# EAGLE design Spectacle_Audio_Output_Board (EAGLE 7.6.0)

## Sheet 1 of 2
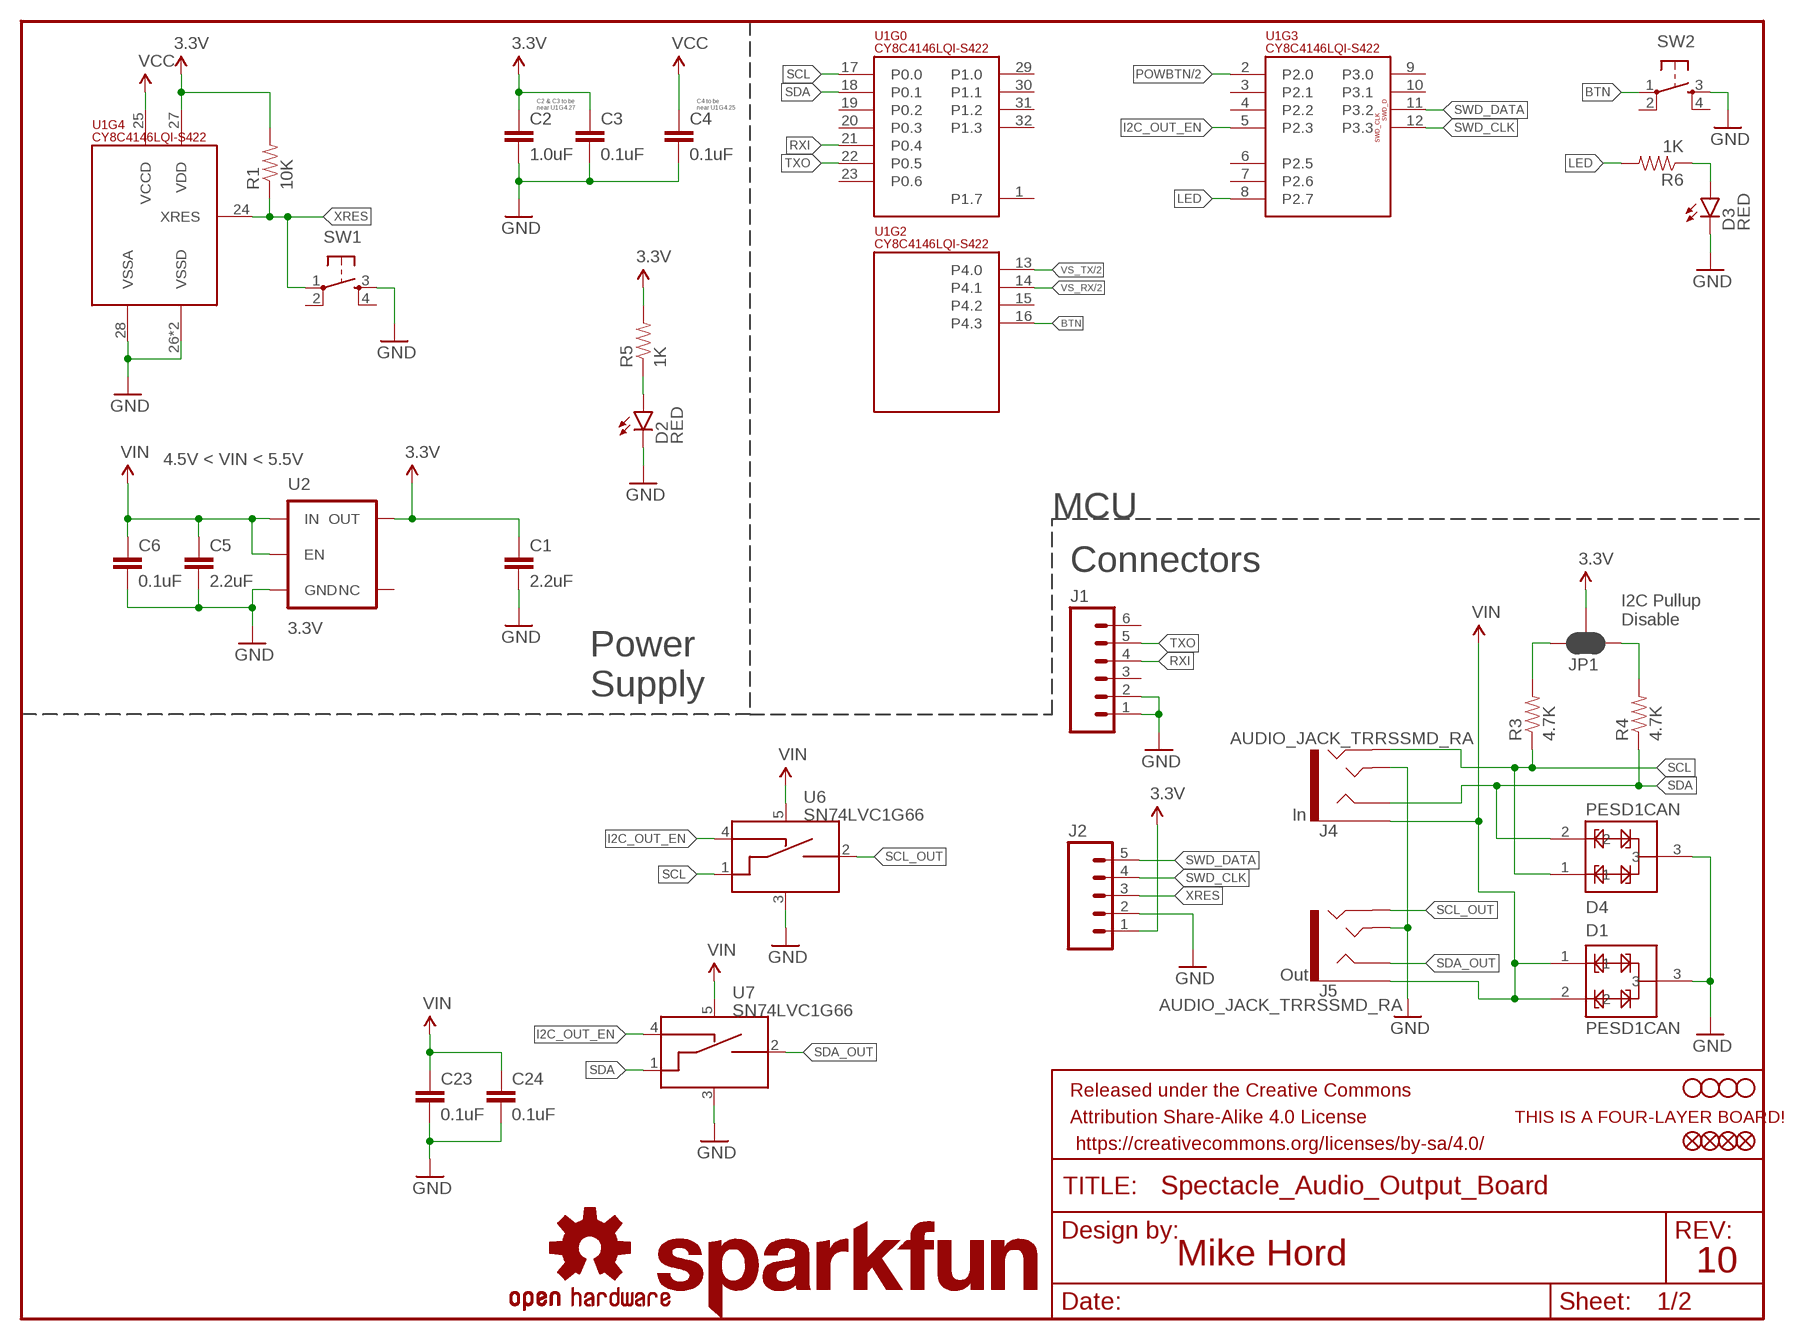
[diagram p0: schematic, sheet 1]

### Parts
C1  2.2uF  2.2UF-10V-20%(0603)  [0603-CAP]
C2  1.0uF  1.0UF-16V-10%(0402)  [0402-CAP]
C3  0.1uF  0.1UF-16V(+-10%)(0402)  [0402-CAP]
C4  0.1uF  0.1UF-16V(+-10%)(0402)  [0402-CAP]
C5  2.2uF  2.2UF-10V-20%(0603)  [0603-CAP]
C6  0.1uF  0.1UF-16V(+-10%)(0402)  [0402-CAP]
C23  0.1uF  0.1UF-16V(+-10%)(0402)  [0402-CAP]
C24  0.1uF  0.1UF-16V(+-10%)(0402)  [0402-CAP]
D1  PESD1CAN  [SOT23-3]
D2  RED  LED-RED0603  [LED-0603]
D3  RED  LED-RED0603  [LED-0603]
D4  PESD1CAN  [SOT23-3]
FD5  FIDUCIALUFIDUCIAL  [MICRO-FIDUCIAL]
FD6  FIDUCIALUFIDUCIAL  [MICRO-FIDUCIAL]
FD7  FIDUCIALUFIDUCIAL  [MICRO-FIDUCIAL]
FD8  FIDUCIALUFIDUCIAL  [MICRO-FIDUCIAL]
FRAME1  FRAME-LETTER  [CREATIVE_COMMONS]
H1  STAND-OFF  [STAND-OFF]
H2  STAND-OFF  [STAND-OFF]
H3  STAND-OFF  [STAND-OFF]
H4  STAND-OFF  [STAND-OFF]
J1  M06NO_SILK_NO_POP  [1X06_NO_SILK]
J2  M05NO_SILK  [1X05_NO_SILK]
J4  AUDIO_JACK_TRRSSMD_RA  [AUDIO_JACK_3.5MM_TRRS_SMD_RA]
J5  AUDIO_JACK_TRRSSMD_RA  [AUDIO_JACK_3.5MM_TRRS_SMD_RA]
JP1  JUMPER-PAD-3-NC_BY_PASTE  [PAD-JUMPER-3-NC_BY_PASTE_YES_SILK_FULL_BOX]
LOGO1  OSHW-LOGOS  [OSHW-LOGO-S]
LOGO2  SFE_LOGO_NAME.1_INCH  [SFE_LOGO_NAME_.1]
R1  10K  10KOHM-1/10W-1%(0603)0603  [0603-RES]
R3  4.7K  4.7KOHM-1/10W-1%(0603)  [0603-RES]
R4  4.7K  4.7KOHM-1/10W-1%(0603)  [0603-RES]
R5  1K  1KOHM-1/10W-1%(0603)  [0603-RES]
R6  1K  1KOHM-1/10W-1%(0603)  [0603-RES]
SW1  SWITCH_SPST_4_PINRECT  [TACTILE_SWITCH_SMD_4.6X2.8MM]
SW2  SWITCH_SPST_4_PINRECT  [TACTILE_SWITCH_SMD_4.6X2.8MM]
U1  CY8C4146LQI-S422  PSOC4_4100S_32QFN  [QFN-32]
U2  3.3V  V_REG_AP2112K-3.3V  [SOT23-5]
U6  SN74LVC1G66  SN74LVC1G66_SPST_AMUX  [SOT23-5]
U7  SN74LVC1G66  SN74LVC1G66_SPST_AMUX  [SOT23-5]
U$1  FOUR_LAYER_WARNING  [FOUR_LAYER_WARNING]

### Nets
3.3V: C1.1 C2.1 C3.1 J2.1 JP1.2 R1.2 R5.2 U1.27(VDD) U2.5(OUT) ; also sheet 2
BTN: SW2.1 U1.16(P4.3)
GND: C1.2 C2.2 C3.2 C4.2 C5.2 C6.2 C23.2 C24.2 D1.3 D2.C D3.C D4.3 J1.1 J1.2 J2.2 J4.TIP J5.TIP SW1.3 SW2.3 U1.26(VSSD) U1.28(VSSA) U1.EP(VSSD) U2.2(GND) U6.3(VSS) U7.3(VSS) ; also sheet 2
I2C_OUT_EN: U1.5(P2.3) U6.4(CTRL_IN) U7.4(CTRL_IN)
LED: R6.2 U1.8(P2.7)
N$2: JP1.3 R3.2
N$4: D2.A R5.1
N$5: D3.A R6.1
N$6: JP1.1 R4.2
POWBTN: U1.2(P2.0) ; also sheet 2
RXI: J1.4 U1.21(P0.4)
SCL: D4.1 J4.RING2 R3.1 U1.17(P0.0) U6.1(A_IN)
SCL_OUT: J5.RING2 U6.2(A_OUT)
SDA: D4.2 J4.RING1 R4.1 U1.18(P0.1) U7.1(A_IN)
SDA_OUT: J5.RING1 U7.2(A_OUT)
SWD_CLK: J2.4 U1.12(P3.3)
SWD_DATA: J2.5 U1.11(P3.2)
TXO: J1.5 U1.22(P0.5)
VCC: C4.1 U1.25(VCCD)
VIN: C5.1 C6.1 C23.1 C24.1 D1.1 D1.2 J4.EARTH J5.EARTH U2.1(IN) U2.3(EN) U6.5(VCC) U7.5(VCC) ; also sheet 2
VS_RX: U1.14(P4.1) ; also sheet 2
VS_TX: U1.13(P4.0) ; also sheet 2
XRES: J2.3 R1.1 SW1.1 U1.24(XRES)
Unconnected: J1.3 J1.6 SW1.2 SW1.4 SW2.2 SW2.4 U1.1(P1.7) U1.3(P2.1) U1.4(P2.2) U1.6(P2.5) U1.7(P2.6) U1.9(P3.0) U1.10(P3.1) U1.15(P4.2) U1.19(P0.2) U1.20(P0.3) U1.23(P0.6) U1.29(P1.0) U1.30(P1.1) U1.31(P1.2) U1.32(P1.3) U2.4(NC)

### Notes on the sheet
- C2 & C3 to be
  near U1G4.27
- C4 to be
  near U1G4.25
- 4.5V < VIN < 5.5V
- MCU
- Connectors
- I2C Pullup
  Disable
- Power
  Supply
- In
- Out
- Mike Hord | 10

## Sheet 2 of 2
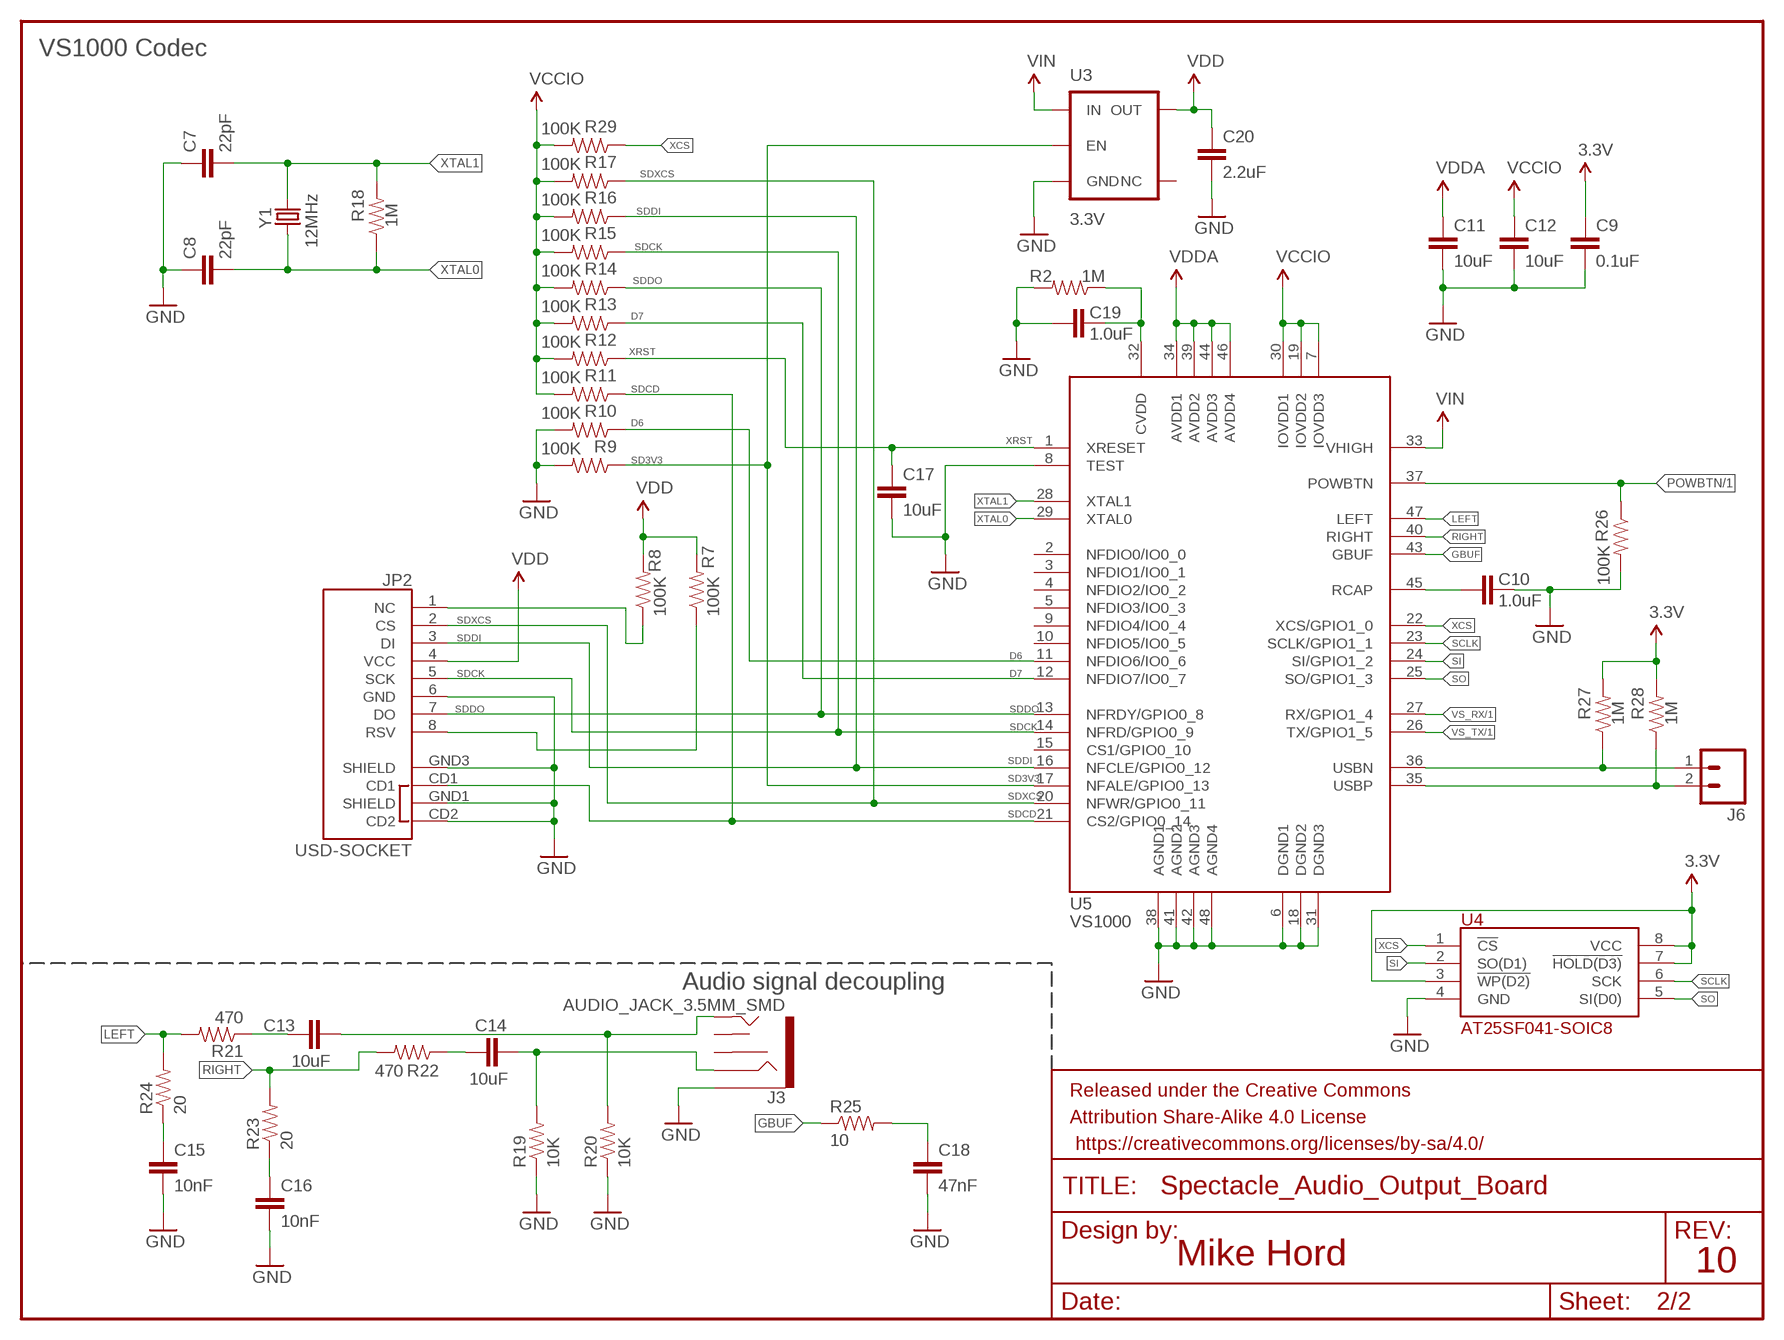
[diagram p1: schematic, sheet 2]

### Parts
C7  22pF  22PF-50V-5%(0603)  [0603-CAP]
C8  22pF  22PF-50V-5%(0603)  [0603-CAP]
C9  0.1uF  0.1UF-16V(+-10%)(0402)  [0402-CAP]
C10  1.0uF  1.0UF-16V-10%(0402)  [0402-CAP]
C11  10uF  10UF-6.3V-20%(0603)  [0603-CAP]
C12  10uF  10UF-6.3V-20%(0603)  [0603-CAP]
C13  10uF  10UF-6.3V-20%(0603)  [0603-CAP]
C14  10uF  10UF-6.3V-20%(0603)  [0603-CAP]
C15  10nF  10NF/10000PF-50V-10%(0603)  [0603-CAP]
C16  10nF  10NF/10000PF-50V-10%(0603)  [0603-CAP]
C17  10uF  10UF-6.3V-20%(0603)  [0603-CAP]
C18  47nF  47NF(0.047UF/47000PF)-25V-5%(0603)SMD  [0603-CAP]
C19  1.0uF  1.0UF-16V-10%(0402)  [0402-CAP]
C20  2.2uF  2.2UF-10V-20%(0603)  [0603-CAP]
FRAME2  FRAME-LETTER  [CREATIVE_COMMONS]
J3  AUDIO_JACK_3.5MM_SMD  [AUDIO-JACK-3.5MM-SMD]
J6  M021X02_NO_SILK  [1X02_NO_SILK]
JP2  USD-SOCKET  [MICROSD_1:1]
R2  1M  1MOHM-1/10W-1%(0603)  [0603-RES]
R7  100K  100KOHM-1/16W-1%(0402)  [0402-RES]
R8  100K  100KOHM-1/16W-1%(0402)  [0402-RES]
R9  100K  100KOHM-1/16W-1%(0402)  [0402-RES]
R10  100K  100KOHM-1/16W-1%(0402)  [0402-RES]
R11  100K  100KOHM-1/16W-1%(0402)  [0402-RES]
R12  100K  100KOHM-1/16W-1%(0402)  [0402-RES]
R13  100K  100KOHM-1/16W-1%(0402)  [0402-RES]
R14  100K  100KOHM-1/16W-1%(0402)  [0402-RES]
R15  100K  100KOHM-1/16W-1%(0402)  [0402-RES]
R16  100K  100KOHM-1/16W-1%(0402)  [0402-RES]
R17  100K  100KOHM-1/16W-1%(0402)  [0402-RES]
R18  1M  1MOHM-1/10W-1%(0603)  [0603-RES]
R19  10K  10KOHM-1/10W-1%(0603)0603  [0603-RES]
R20  10K  10KOHM-1/10W-1%(0603)0603  [0603-RES]
R21  470  470OHM1/10W1%(0603)  [0603-RES]
R22  470  470OHM1/10W1%(0603)  [0603-RES]
R23  20  20OHM1/10W1%(0603)SMD  [0603-RES]
R24  20  20OHM1/10W1%(0603)SMD  [0603-RES]
R25  10  10OHM-1/10W-5%0603SMD  [0603-RES]
R26  100K  100KOHM-1/16W-1%(0402)  [0402-RES]
R27  1M  1MOHM-1/10W-1%(0603)  [0603-RES]
R28  1M  1MOHM-1/10W-1%(0603)  [0603-RES]
R29  100K  100KOHM-1/16W-1%(0402)  [0402-RES]
U3  3.3V  V_REG_AP2112K-3.3V  [SOT23-5]
U4  AT25SF041-SOIC8  AT25SF041  [SO08]
U5  VS1000  [LQFP-48]
Y1  12MHz  CRYSTALCRYSTAL-SMD-5X3-12MHZ  [CRYSTAL-SMD-5X3]

### Nets
3.3V: C9.1 R27.2 R28.2 U4.3(!WP(D2)) U4.7(!HOLD(D3)) U4.8(VCC) ; also sheet 1
D6: R10.1 U5.11(NFDIO6/IO0_6)
D7: R13.1 U5.12(NFDIO7/IO0_7)
GBUF: R25.1 U5.43(GBUF)
GND: C7.1 C8.1 C9.2 C10.2 C11.2 C12.2 C15.2 C16.2 C17.2 C18.2 C19.1 C20.2 J3.SLEEVE JP2.6(GND) JP2.CD2 JP2.GND1(SHIELD) JP2.GND3(SHIELD) R2.2 R9.2 R10.2 R19.1 R20.1 R26.2 U3.2(GND) U4.4(GND) U5.6(DGND1) U5.8(TEST) U5.18(DGND2) U5.31(DGND3) U5.38(AGND1) U5.41(AGND2) U5.42(AGND3) U5.48(AGND4) ; also sheet 1
L_AC: C13.2 J3.TIP R20.2
LEFT: R21.2 R24.2 U5.47(LEFT)
N$1: JP2.1(NC) R8.1
N$7: JP2.8(RSV) R7.1
N$8: C13.1 R21.1
N$9: C15.1 R24.1
N$10: C18.1 R25.2
N$11: C10.1 U5.45(RCAP)
N$12: C19.2 R2.1 U5.32(CVDD)
N$17: C14.1 R22.1
N$20: C16.1 R23.1
POWBTN: R26.1 U5.37(POWBTN) ; also sheet 1
R_AC: C14.2 J3.RING R19.2
RIGHT: R22.2 R23.2 U5.40(RIGHT)
SCLK: U4.6(SCK) U5.23(SCLK/GPIO1_1)
SD3V3: R9.1 U3.3(EN) U5.17(NFALE/GPIO0_13)
SDCD: JP2.CD1 R11.1 U5.21(CS2/GPIO0_14)
SDCK: JP2.5(SCK) R15.1 U5.14(NFRD/GPIO0_9)
SDDI: JP2.3(DI) R16.1 U5.16(NFCLE/GPIO0_12)
SDDO: JP2.7(DO) R14.1 U5.13(NFRDY/GPIO0_8)
SDXCS: JP2.2(CS) R17.1 U5.20(NFWR/GPIO0_11)
SI: U4.2(SO(D1)) U5.24(SI/GPIO1_2)
SO: U4.5(SI(D0)) U5.25(SO/GPIO1_3)
USBN: J6.1 R27.1 U5.36(USBN)
USBP: J6.2 R28.1 U5.35(USBP)
VCCIO: C12.1 R11.2 R12.2 R13.2 R14.2 R15.2 R16.2 R17.2 R29.2 U5.7(IOVDD3) U5.19(IOVDD2) U5.30(IOVDD1)
VDD: C20.1 JP2.4(VCC) R7.2 R8.2 U3.5(OUT)
VDDA: C11.1 U5.34(AVDD1) U5.39(AVDD2) U5.44(AVDD3) U5.46(AVDD4)
VIN: U3.1(IN) U5.33(VHIGH) ; also sheet 1
VS_RX: U5.27(RX/GPIO1_4) ; also sheet 1
VS_TX: U5.26(TX/GPIO1_5) ; also sheet 1
XCS: R29.1 U4.1(!CS) U5.22(XCS/GPIO1_0)
XRST: C17.1 R12.1 U5.1(XRESET)
XTAL0: C8.2 R18.1 U5.29(XTAL0) Y1.1
XTAL1: C7.2 R18.2 U5.28(XTAL1) Y1.3
Unconnected: J3.RSH J3.TSH U3.4(NC) U5.2(NFDIO0/IO0_0) U5.3(NFDIO1/IO0_1) U5.4(NFDIO2/IO0_2) U5.5(NFDIO3/IO0_3) U5.9(NFDIO4/IO0_4) U5.10(NFDIO5/IO0_5) U5.15(CS1/GPIO0_10)

### Notes on the sheet
- VS1000 Codec
- Audio signal decoupling
- Mike Hord | 10

## Library data of the parts
C1 C5 C20 = SparkFun-Capacitors:2.2UF-10V-20%(0603): CAP-07888; PROD_ID: CAP-07888
C2 C10 C19 = SparkFun-Capacitors:1.0UF-16V-10%(0402); PROD_ID: CAP-12417
C3 C4 C6 C9 C23 C24 = SparkFun-Capacitors:0.1UF-16V(+-10%)(0402); PROD_ID: CAP-12416
C7 C8 = SparkFun-Capacitors:22PF-50V-5%(0603): CAP-07876; PROD_ID: CAP-07876
C11-C14 C17 = SparkFun-Capacitors:10UF-6.3V-20%(0603): CAP-11015; PROD_ID: CAP-11015
C15 C16 = SparkFun-Capacitors:10NF/10000PF-50V-10%(0603): CAP-00867; PROD_ID: CAP-00867
C18 = SparkFun-Capacitors:47NF(0.047UF/47000PF)-25V-5%(0603): CAP-08605; PROD_ID: CAP-08605
D1 D4 = SparkFun-DiscreteSemi:PESD1CAN: PESD1CAN is used to protect two automotive CAN bus lines from ESD.; PROD_ID: DIO-12501
D2 D3 = SparkFun-LED:LED-RED: Assorted Red LEDs LilyPad 1206- DIO-09912 1206- DIO-00809 0603- DIO-00819 "SMART" means more efficient and expensive; PROD_ID: DIO-00819
FD5-FD8 = SparkFun-Aesthetics:FIDUCIAL: Fiducial Alignment Points Various fiducial points for machine vision alignment.
FRAME1 FRAME2 = SparkFun-Aesthetics:FRAME-LETTER: Schematic Frame Standard 8.5x11 US Letter frame
H1-H4 = SparkFun-Electromechanical:STAND-OFF: #4 Stand Off This is the mechanical footprint for a #4 phillips button head screw. Use the keepout ring to avoid running the screw head into surrounding components. SKU : PRT-00447
J1 = SparkFun-Connectors:M06: Header 6 Standard 6-pin 0.1" header. Use with straight break away headers (SKU : PRT-00116), right angle break away headers (PRT-00553), swiss pins (PRT-00743), machine pins (PRT-00117), and female headers (PRT-00115). Molex polarized connector foot print use with SKU : PRT-08094 with associated crimp pins and housings. NOTES ON THE VARIANTS LOCK and LOCK_LONGPADS... This footprint was designed to help hold the alignment of a through-hole component (i.e. 6-pin header) while soldering it into place. You may notice that each hole has been shifted either up or down by 0.005 of an inch from it's more standard position (which is a perfectly straight line). This slight alteration caused the pins (the squares in the middle) to touch the edges of the holes. Because they are alternating, it causes a "brace" to hold the component in place. 0.005 has proven to be the perfect amount of "off-center" position when using our standard breakaway headers. Although looks a little odd when you look at the bare footprint, once you have a header in there, the alteration is very hard to notice. Also,if you push a header all the way into place, it is covered up entirely on the bottom side. This idea of altering the position of holes to aid alignment will be further integrated into the Sparkfun Library for other footprints. It can help hold any component with 3 or more connection pins.
J2 = SparkFun-Connectors:M05: Header 5 Standard 5-pin 0.1" header. Use with straight break away headers (SKU : PRT-00116), right angle break away headers (PRT-00553), swiss pins (PRT-00743), machine pins (PRT-00117), and female headers (PRT-00115). Molex polarized connector foot print use with SKU : PRT-08230 with associated crimp pins and housings.
J3 = SparkFun-Connectors:AUDIO_JACK_3.5MM: Audio Jack 3.5mm variants of PTH and SMT stereo audio jack with bypass switches. SparkFun Products: SparkFun SparkPunk Sound Kit <[https://www.sparkfun.com/products/11177]> - PTH MP3 Trigger <https://www.sparkfun.com/products/13720> -3.5mm SMD SparkFun PicoBoard <https://www.sparkfun.com/products/11888>- 2.5mm SMD; PROD_ID: CONN-10353
J4 J5 = SparkFun-Connectors:AUDIO_JACK_TRRS: Audio Jack - 3.5mm TRRS (SMD) This is a 3.5mm TRRS SMD audio jack. TRRS connectors are the audio-style connectors that you see on some phones, MP3 players and development boards. TRRS stands for “tip, ring, ring, sleeve,” which reflects that this has three conductors and a ground. SparkFun Products: Audio Jack <https://www.sparkfun.com/products/12639> mbed Starter Kit <https://www.sparkfun.com/products/12968> SparkFun TRRS 3.5mm Jack Breakout <https://www.sparkfun.com/products/11570>; PROD_ID: CONN-10676; SF_ID: PRT-12639
J6 = SparkFun-Connectors:M02: Standard 2-pin 0.1" header. Use with - straight break away headers ( PRT-00116) - right angle break away headers (PRT-00553) - swiss pins (PRT-00743) - machine pins (PRT-00117) - female headers (PRT-00115) Molex polarized connector foot print use with: PRT-08233 with associated crimp pins and housings. 2.54_SCREWTERM for use with PRT-10571. 3.5mm Screw Terminal footprints for PRT-08084 5mm Screw Terminal footprints for use with PRT-08432
JP1 = SparkFun-Passives:JUMPER-PAD-3-NC_BY_PASTE
JP2 = SparkFun-Connectors:USD-SOCKET: microSD Socket Push-push type uSD socket. Schematic element and footprint production proven. Spark Fun Electronics SKU : PRT-00127. tDoc lines correctly indicate media card edge positions when inserting (unlocked, locked, depressed). NOTE: CD1 and CD2 are connected internally; PROD_ID: CONN-07820
LOGO1 = SparkFun-Aesthetics:OSHW-LOGO: Open Source Hardware Logo This logo indicates the piece of hardware it is found on incorporates a OSHW license and/or adheres to the definition of open source hardware found here: http://freedomdefined.org/OSHW
LOGO2 = SparkFun-Aesthetics:SFE_LOGO_NAME: SFE Logo, name only This is the SparkFun name logo. The logo on the schematic will always be the same size; the package variant is the height of the flame part of the logo (or the height the flame would be, if it were drawn). Default layer for the logo on the board is tSilk.
R1 R19 R20 = SparkFun-Resistors:10KOHM-1/10W-1%(0603): RES-00824; PROD_ID: RES-00824
R2 R18 R27 R28 = SparkFun-Resistors:1MOHM-1/10W-1%(0603): RES-07868; PROD_ID: RES-07868
R3 R4 = SparkFun-Resistors:4.7KOHM-1/10W-1%(0603): RES-07857; PROD_ID: RES-07857
R5 R6 = SparkFun-Resistors:1KOHM-1/10W-1%(0603): RES-07856; PROD_ID: RES-07856
R7-R17 R26 R29 = SparkFun-Resistors:100KOHM-1/16W-1%(0402); PROD_ID: RES-13495
R21 R22 = SparkFun-Resistors:470OHM1/10W1%(0603): RES-07869; PROD_ID: RES-07869
R23 R24 = SparkFun-Resistors:20OHM1/10W1%(0603): RES-07862; PROD_ID: RES-07862
R25 = SparkFun-Resistors:10OHM-1/10W-5%0603: RES-09834; PROD_ID: RES-09834
SW1 SW2 = SparkFun-Electromechanical:SWITCH_SPST_4_PIN; PROD_ID: SWCH-13065
U1 = SparkFun-DigitalIC:PSOC4_4100S_32QFN; PROD_ID: IC-13286
U2 U3 = SparkFun-PowerIC:V_REG_AP2112: AP2112 - 600mA CMOS LDO Regulator w/ Enable The AP2112 is CMOS process low dropout linear regulator with enable function, the regulator delivers a guaranteed 600mA (min.) continuous load current. Features Output Voltage Accuracy: ±1.5% Output Current: 600mA (Min.) Foldback Short Current Protection: 50mA Enable Function to Turn ON/OFF VOUT Low Dropout Voltage (3.3V): 250mV (Typ.) @IOUT=600mA Excellent Load Regulation: 0.2%/A (Typ.) Excellent Line Regulation: 0.02%/V (Typ.) Low Quiescent Current: 55μA (Typ.) Low Standby Current: 0.01μA (Typ.) Low Output Noise: 50μVRMS PSRR: 100Hz -65dB, 1kHz -65dB OTSD Protection Stable with 1.0μF Flexible Cap: Ceramic, Tantalum and Aluminum Electrolytic Operation Temperature Range: -40°C to 85°C ESD: MM 400V, HBM 4000V; PROD_ID: VREG-12457
U4 = SparkFun-DigitalIC:AT25SF041: SPI Serial flash memory with dual/quad-IO support; PROD_ID: IC-12455
U5 = SparkFun-DigitalIC:VS1000: OGG Vorbis codec; PROD_ID: LPA-12743
U6 U7 = SparkFun-AnalogIC:SN74LVC1G66_SPST_AMUX: SPST NO Analog Switch 10-Ohm on resistance 1.65-5.5V; PROD_ID: IC-13549
U$1 = SparkFun-Aesthetics:FOUR_LAYER_WARNING: Warning text which will appear on both the schematic and the board file, notifying viewers that the design is a four-layer PCB.
Y1 = SparkFun-FreqCtrl:CRYSTAL: Various standard crystals. Proven footprints.; PROD_ID: XTAL-08297

## Board
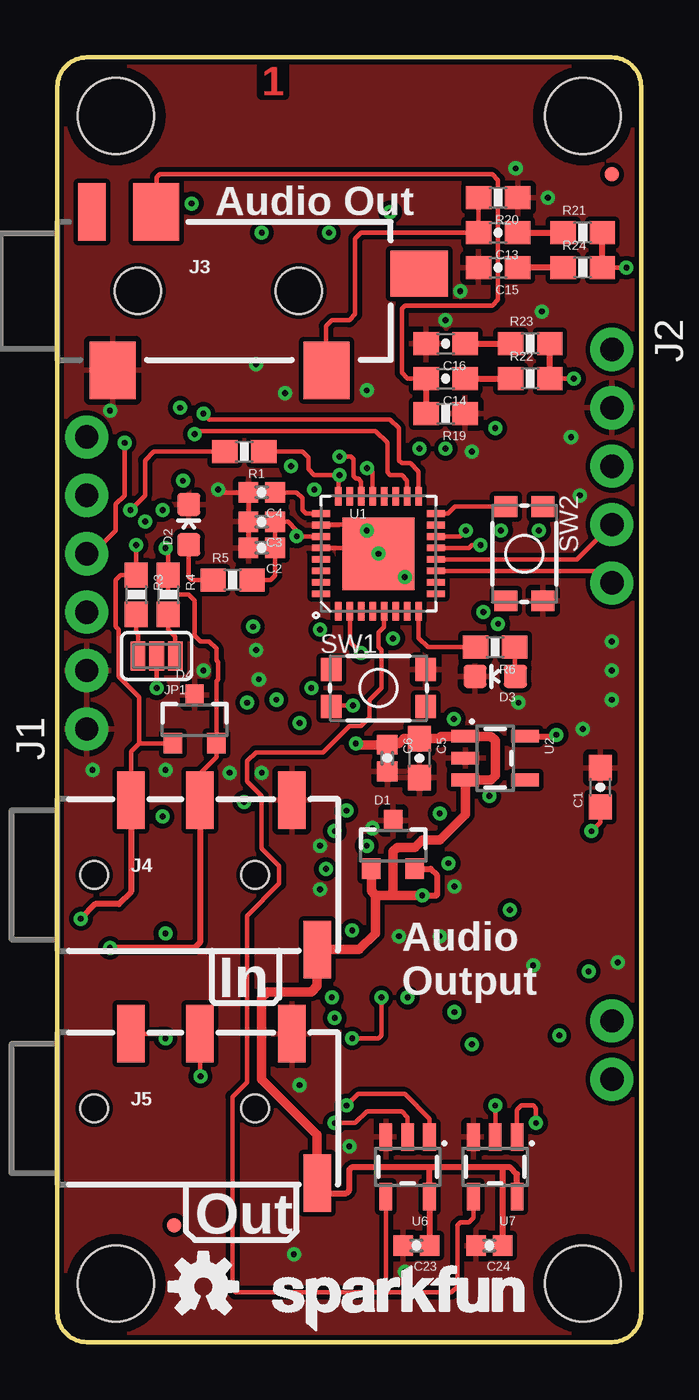
[diagram p2: board, top side]
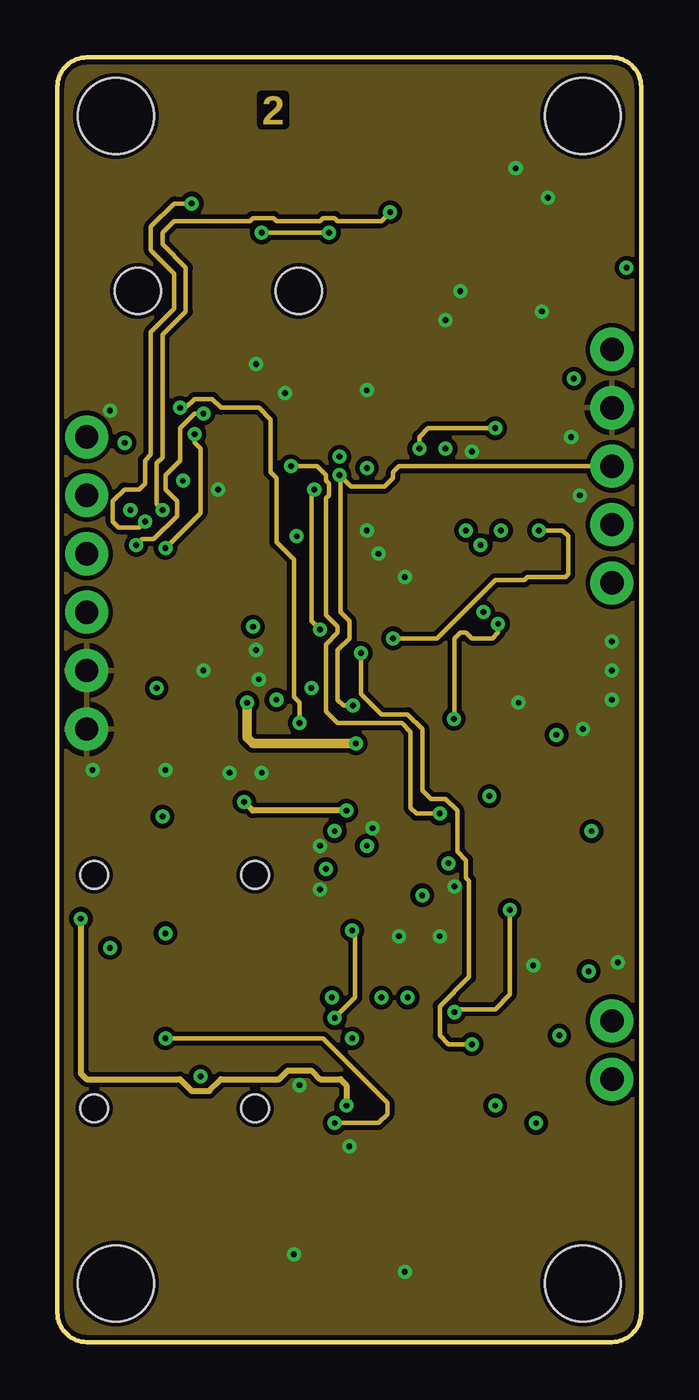
[diagram p3: board, inner layer Route2]
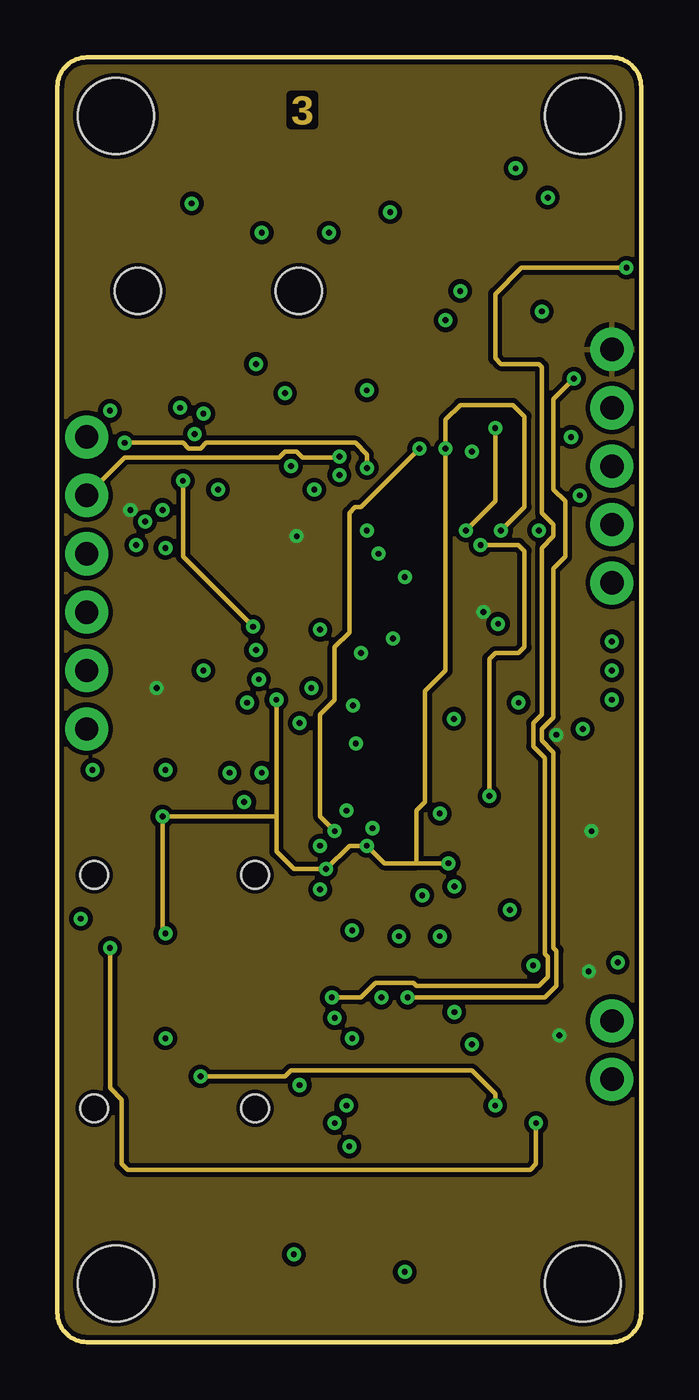
[diagram p4: board, inner layer Route15]
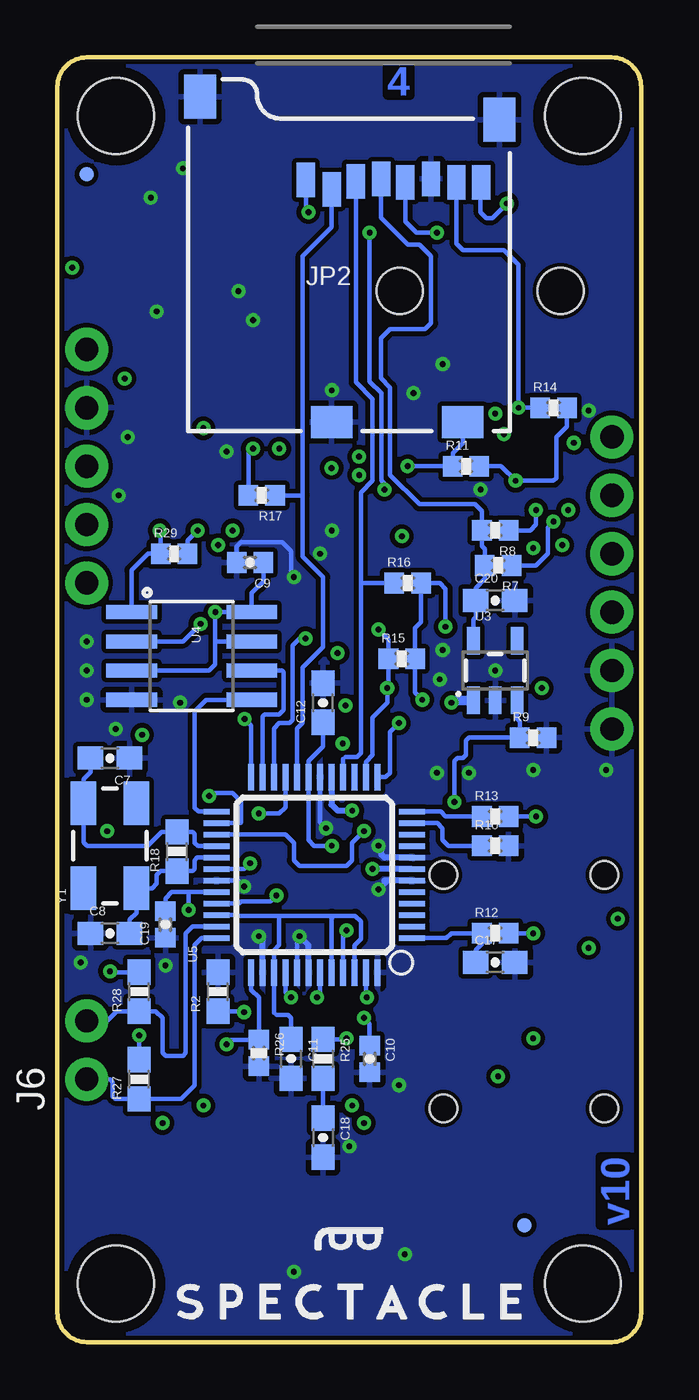
[diagram p5: board, bottom side, seen from below]

Size 25.4 x 55.88 mm. Coordinates in mm from the lower left corner, seen from the top.
Outline: 24.13,0 1.27,0 arc-90 0,1.27 0,54.61 arc-90 1.27,55.88 24.13,55.88 arc-90 25.4,54.61 25.4,1.27 arc-90 24.13,0
Copper layers (1*2*15*16): Top 0.035559375mm / dielectric 0.47751875mm / Route2 0.035559375mm / dielectric 0.47751875mm / Route15 0.035559375mm / dielectric 0.47751875mm / Bottom 0.035559375mm
Design rules "SparkFun-4-layer-TIGHT *": minimum track width 7mil, minimum drill 10mil, track to track 7mil, track to pad 7mil, pad to pad 7mil, via to via 7mil, smd to smd 7mil, copper to edge 7mil, drill to drill 7mil, minimum pad ring 7mil, minimum via ring 7mil, stop-mask expansion 4mil, vias tented up to drill 25mil, thermal gap 10mil
tRestrict: area 15.5,34 to 15.6,34.5; area 13.6,35.8 to 14.4,36.2; area 12.3,33.9 to 12.6,34.5; area 13.7,32.6 to 14.2,32.9
bRestrict: area 14.6,15.9 to 14.9,16.3

### Footprints (pad centres in the part's own frame; a part is rotated, then mirrored left to right if it is on the bottom)
0603-CAP = smd 1.1 x 1: 1 -0.85,0; 2 0.85,0
0402-CAP = smd 0.85 x 0.9: 1 -0.58,0; 2 0.58,0
SOT23-3 = smd 0.8 x 0.9: 1 -0.95,-1; 2 0.95,-1; 3 0,1.1
LED-0603 = smd 1 x 1: A 0,-0.877; C 0,0.877
MICRO-FIDUCIAL = smd 0.635 x 0.635: 1 0,0
STAND-OFF = hole 3.302: 0,0
1X06_NO_SILK = drill 1.016 pad 1.88: 1 0,0; 2 2.54,0; 3 5.08,0; 4 7.62,0; 5 10.16,0; 6 12.7,0
1X05_NO_SILK = drill 1.016 pad 1.88: 1 0,0; 2 2.54,0; 3 5.08,0; 4 7.62,0; 5 10.16,0
AUDIO-JACK-3.5MM-SMD = smd 2 x 2.5: RING 4.3,3.45; SLEEVE 2.4,-3.45; TIP 11.7,-3.45 | smd 1.2 x 2.5: RSH 1.5,3.45 | smd 2.5 x 2: TSH 15.75,0.75 | hole 2: 3.5,0; 10.5,0
AUDIO_JACK_3.5MM_TRRS_SMD_RA = smd 1.2 x 2.5: EARTH 11.3,-3.25; RING1 6.2,3.25; RING2 3.2,3.25; TIP 10.2,3.25 | hole 1.2: 1.6,0; 8.6,0
1X02_NO_SILK = drill 1.016 pad 1.88: 1 0,0; 2 2.54,0
PAD-JUMPER-3-NC_BY_PASTE_YES_SILK_FULL_BOX = smd 0.635 x 1.27: 1 -0.813,0; 2 0,0; 3 0.813,0
MICROSD_1:1 = smd 0.8 x 1.5: 1 5.096,10.919; 2 6.218,10.519; 3 7.274,10.853; 4 8.367,10.982; 5 9.421,10.828; 6 10.539,10.973; 7 11.648,10.819; 8 12.721,10.819 | smd 1.8 x 1.4: CD1 11.92,0.4; CD2 6.22,0.4 | smd 1.4 x 1.9: GND1 0.497,14.55; GND3 13.52,13.55
0603-RES = smd 1.1 x 1: 1 -0.85,0; 2 0.85,0
0402-RES = smd 0.85 x 0.9: 1 -0.58,0; 2 0.58,0
TACTILE_SWITCH_SMD_4.6X2.8MM = smd 0.9 x 1: 1 -2.05,-0.8; 2 2.05,-0.8; 3 2.05,0.8; 4 -2.05,0.8
QFN-32 = smd 0.285 x 0.8: 1 -1.75,-2.5; 2 -1.25,-2.5; 3 -0.75,-2.5; 4 -0.25,-2.5; 5 0.25,-2.5; 6 0.75,-2.5; 7 1.25,-2.5; 8 1.75,-2.5; 17 1.75,2.5; 18 1.25,2.5; 19 0.75,2.5; 20 0.25,2.5; 21 -0.25,2.5; 22 -0.75,2.5; 23 -1.25,2.5; 24 -1.75,2.5 | smd 0.8 x 0.285: 9 2.5,-1.75; 10 2.5,-1.25; 11 2.5,-0.75; 12 2.5,-0.25; 13 2.5,0.25; 14 2.5,0.75; 15 2.5,1.25; 16 2.5,1.75; 25 -2.5,1.75; 26 -2.5,1.25; 27 -2.5,0.75; 28 -2.5,0.25; 29 -2.5,-0.25; 30 -2.5,-0.75; 31 -2.5,-1.25; 32 -2.5,-1.75 | smd 3.15 x 3.15: EP 0,0
SOT23-5 = smd 0.55 x 1.2: 1 -0.95,-1.3; 2 0,-1.3; 3 0.95,-1.3; 4 0.95,1.3; 5 -0.95,1.3
SO08 = smd 0.61 x 2.21: 1 -1.905,-2.616; 2 -0.635,-2.616; 3 0.635,-2.616; 4 1.905,-2.616; 5 1.905,2.616; 6 0.635,2.616; 7 -0.635,2.616; 8 -1.905,2.616
LQFP-48 = smd 0.254 x 1.143: 1 -2.75,-4.25; 2 -2.25,-4.25; 3 -1.75,-4.25; 4 -1.25,-4.25; 5 -0.75,-4.25; 6 -0.25,-4.25; 7 0.25,-4.25; 8 0.75,-4.25; 9 1.25,-4.25; 10 1.75,-4.25; 11 2.25,-4.25; 12 2.75,-4.25; 25 2.75,4.25; 26 2.25,4.25; 27 1.75,4.25; 28 1.25,4.25; 29 0.75,4.25; 30 0.25,4.25; 31 -0.25,4.25; 32 -0.75,4.25; 33 -1.25,4.25; 34 -1.75,4.25; 35 -2.25,4.25; 36 -2.75,4.25 | smd 1.143 x 0.254: 13 4.25,-2.75; 14 4.25,-2.25; 15 4.25,-1.75; 16 4.25,-1.25; 17 4.25,-0.75; 18 4.25,-0.25; 19 4.25,0.25; 20 4.25,0.75; 21 4.25,1.25; 22 4.25,1.75; 23 4.25,2.25; 24 4.25,2.75; 37 -4.25,2.75; 38 -4.25,2.25; 39 -4.25,1.75; 40 -4.25,1.25; 41 -4.25,0.75; 42 -4.25,0.25; 43 -4.25,-0.25; 44 -4.25,-0.75; 45 -4.25,-1.25; 46 -4.25,-1.75; 47 -4.25,-2.25; 48 -4.25,-2.75
CRYSTAL-SMD-5X3 = smd 1.9 x 1.1: 1 -1.85,-1.15; 2 1.85,-1.15; 3 1.85,1.15; 4 -1.85,1.15

### Placement (x,y rotation side)
C1  23.62,24.13 90 top
C2  8.89,34.54 180 top
C3  8.89,35.69 180 top
C4  8.89,36.96 180 top
C5  15.75,25.4 270 top
C6  14.35,25.4 270 top
C7  23.11,25.4 180 bottom
C8  23.11,17.78 0 bottom
C9  17.02,33.91 180 bottom
C10  11.81,12.32 270 bottom
C11  15.24,12.32 270 bottom
C12  13.84,27.81 90 bottom
C13  19.18,48.26 180 top
C14  16.89,41.91 180 top
C15  19.18,46.74 180 top
C16  16.89,43.43 180 top
C17  6.35,16.51 0 bottom
C18  13.84,8.89 270 bottom
C19  20.7,18.16 90 bottom
C20  6.35,32.26 0 bottom
C23  15.62,4.19 180 top
C24  18.8,4.19 180 top
D1  14.61,21.59 0 top
D2  5.71,35.56 0 top
D3  19.05,28.96 90 top
D4  5.97,27.05 0 top
FD5  5.08,5.08 0 bottom
FD6  24.13,50.8 0 bottom
FD7  24.13,50.8 0 top
FD8  5.08,5.08 0 top
FRAME1  59.69,36.83 0 top  (outside the outline)
FRAME2  1.27,-13.97 0 top  (outside the outline)
H1  22.86,53.34 0 top
H2  2.54,53.34 0 top
H3  22.86,2.54 0 top
H4  2.54,2.54 0 top
J1  1.27,26.67 90 top
J2  24.13,43.18 270 top
J3  0,45.72 0 top
J4  0,20.32 0 top
J5  0,10.16 0 top
J6  24.13,11.43 90 bottom
JP1  4.32,29.84 180 top
JP2  19.68,39.62 0 bottom
LOGO1  6.35,2.41 0 top
LOGO2  8.89,0 0 top
R1  8.13,38.73 180 top
R2  18.41,15.24 90 bottom
R3  3.43,32.51 270 top
R4  4.83,32.51 270 top
R5  7.62,33.15 0 top
R6  19.05,30.23 180 top
R7  6.22,33.78 180 bottom
R8  6.35,35.31 180 bottom
R9  4.7,26.29 0 bottom
R10  6.35,21.59 0 bottom
R11  7.62,38.1 0 bottom
R12  6.35,17.78 0 bottom
R13  6.35,22.86 0 bottom
R14  3.81,40.64 0 bottom
R15  10.41,29.72 0 bottom
R16  10.16,33.02 0 bottom
R17  16.51,36.83 180 bottom
R18  20.19,21.34 90 bottom
R19  16.89,40.39 180 top
R20  19.18,49.78 180 top
R21  22.86,48.26 0 top
R22  20.57,41.91 0 top
R23  20.57,43.43 0 top
R24  22.86,46.74 0 top
R25  13.84,12.32 270 bottom
R26  16.64,12.57 270 bottom
R27  21.84,11.43 90 bottom
R28  21.84,15.24 90 bottom
R29  20.32,34.29 0 bottom
SW1  13.97,28.45 0 top
SW2  20.32,34.29 270 top
U1  13.97,34.29 0 top
U2  19.05,25.4 270 top
U3  6.35,29.21 0 bottom
U4  19.56,29.84 270 bottom
U5  14.22,20.32 90 bottom
U6  15.24,7.62 180 top
U7  19.05,7.62 180 top
U$1  39.37,45.72 0 top  (outside the outline)
Y1  23.11,21.59 90 bottom

### Tracks (layer width: path | path; a pad name or v marks a point on that pad's centre or on a via)
3.3V  (via drill 0.25)
  Top 0.203: U1.27 10.43,35.04 v10.41,35.05 10.41,35.31 10.03,35.69 C3.1 C2.1 9.47,33.35 9.27,33.15 R5.2 | R1.2 4.19,38.73 3.81,38.35 3.81,36.83 v3.17,36.2 | JP1.2 v4.32,28.45 | C1.1 23.62,22.61 v23.24,22.23
  Top 0.254: U2.5 21.65,26.35 v21.72,26.42
  Bottom 0.203: R28.2 23.07,16.09 v23.11,16.13 | R27.2 v21.84,13.34 | C9.1 16.44,33.09 16.94,32.59 U4.8 v18.53,31.75 18.53,30.48 | U4.3 18.8,29.21 18.53,29.47 18.53,30.48 | U4.7 18.53,30.48
  pour Route15 (isolate 0.203, rank 2): 24.13,0 1.27,0 arc-90 0,1.27 0,54.61 arc-90 1.27,55.88 24.13,55.88 arc-90 25.4,54.61 25.4,1.27 arc-90
BTN
  Top 0.203: U1.16 16.99,36.04 17.29,36.34 SW2.1
D6
  Bottom 0.203: U5.11 8.85,22.57 8.64,22.35 8.64,21.84 8.38,21.59 R10.1
D7
  Bottom 0.203: U5.12 8.72,23.07 8.51,22.86 R13.1
GBUF  (via drill 0.25)
  Top 0.203: v12.83,13.21 13.97,13.21 14.1,13.34 v14.1,14.99
  Bottom 0.203: U5.43 13.97,15.11 v14.1,14.99 | R25.1 12.87,13.17 v12.83,13.21
GND  (via drill 0.25)
  Top 0.203: U1.26 11.49,35.56 12.7,35.56 U1.EP 13.72,34.54 U1.28 | C2.2 C3.2 C4.2 7.11,36.96 v6.99,37.08
  Bottom 0.203: U5.41 14.97,17.54 v14.86,17.65 | U5.18 13.97,22.61 v13.72,22.35 | C9.2 17.6,34.6 17.4,34.8 15.62,34.8 15.24,34.42 15.24,33.4 v15.11,33.27 | U5.31 17.53,20.07 v17.27,19.81
  Bottom 0.254: U5.42 14.47,17.27 v14.86,17.65 | U5.38 16.47,17.49 v16.64,17.65 | 11.18,20.07 11.17,20.07 U5.6 11.04,20.07 v11.43,19.68 | U5.8 11.16,21.07 11.3,21.21 11.3,21.46 v11.43,21.59
  other vias: 24.38,16.51 13.97,34.29 20.7,16.38 22.86,26.67 6.35,29.21 21.34,49.78 19.94,51.05 16.89,44.45 13.46,41.4 17.53,45.72 9.91,41.27 8.64,42.55 13.46,35.31 2.29,40.51 18.03,38.73 22.35,39.37 22.73,36.83 21.08,44.83 24.13,30.48 24.13,29.21 24.13,27.94 20.07,27.81 8.64,30.1 8.76,28.83 8.89,24.77 7.49,24.77 4.7,24.89 1.52,24.89 10.29,3.81 10.54,11.18 15.11,3.05 12.7,8.51
  pour Bottom (isolate 0.203, rank 2): 0,1.27 0,54.61 arc-90 1.27,55.88 24.13,55.88 arc-90 25.4,54.61 25.4,1.27 arc-90 24.13,0 1.27,0 arc-90
  pour Top (isolate 0.203, rank 2): 0,1.27 0,54.61 arc-90 1.27,55.88 24.13,55.88 arc-90 25.4,54.61 25.4,1.27 arc-90 24.13,0 1.27,0 arc-90
  pour Route2 (isolate 0.203): 24.13,0 1.27,0 arc-90 0,1.27 0,54.61 arc-90 1.27,55.88 24.13,55.88 arc-90 25.4,54.61 25.4,1.27 arc-90
I2C_OUT_EN
  Top 0.203: U1.5 14.22,31.11 13.97,30.86 13.97,30.23 14.1,30.1 14.1,28.45 13.59,27.94 13.59,27.18 13.21,26.8 12.7,26.8 11.56,25.65 8.64,25.65 8.26,25.27 8.26,24.38 8.89,23.75 8.89,21.46 9.65,20.7 9.65,19.94 8.26,18.54 8.26,11.3 7.62,10.67 7.62,2.29 7.75,2.16 14.35,2.16 | 14.35,2.16 17.14,2.16 17.4,2.41 17.4,5.08 17.53,5.21 17.91,5.21 18.1,5.4 U7.4 | U6.4 14.29,2.22 14.35,2.16
L_AC
  Top 0.203: R20.2 C13.2 13.21,48.26 12.95,48.01 12.95,44.7 12.7,44.45 11.94,44.45 11.68,44.2 11.68,42.29 J3.TIP
LED
  Top 0.203: U1.8 15.72,30.64 16.13,30.23 R6.2
LEFT  (via drill 0.25)
  Top 0.203: R24.2 v24.77,46.74
  Top 0.254: R24.2 R21.2
  Route15 0.203: v11.94,14.99 13.21,14.99 13.84,15.62 15.49,15.62 15.62,15.49 20.95,15.49 21.34,15.88 21.34,16.76 21.21,16.89 21.21,25.4 20.7,25.91 20.7,26.92 21.08,27.3 21.08,34.54 21.59,35.05 21.59,35.56 21.08,36.07 21.08,42.42 20.95,42.55 19.3,42.55 19.05,42.8 19.05,45.59 20.19,46.74 v24.77,46.74
  Bottom 0.203: U5.47 11.97,15.02 v11.94,14.99
N$1  (via drill 0.25)
  Route2 0.203: v14.48,49.15 14.1,48.77 12.19,48.77 12.06,48.9 11.56,48.9 11.43,48.77 9.53,48.77 9.4,48.9 8.51,48.9 8.38,48.77 5.08,48.77 4.57,48.26 4.57,47.75 5.59,46.74 5.59,44.83 4.57,43.81 4.57,38.48 4.32,38.23 4.32,36.45 v4.57,36.2
  Bottom 0.203: R8.1 4.83,35.31 4.57,35.56 v4.57,36.2 | 14.61,50.53 JP2.1 14.59,49.26 v14.48,49.15
N$2
  Top 0.203: R3.2 3.43,30.86 3.5,30.79 JP1.3
N$4
  Top 0.203: R5.1 5.84,33.15 5.71,33.27 D2.A
N$5
  Top 0.203: R6.1 19.9,28.98 D3.A
N$6
  Top 0.203: R4.2 4.83,30.99 5.13,30.68 JP1.1
N$7  (via drill 0.25)
  Route2 0.203: v5.84,49.53 5.08,49.53 4.06,48.51 4.06,47.5 5.08,46.48 5.08,44.96 4.06,43.94 4.06,38.61 3.81,38.35 3.81,37.34 3.56,37.08 2.92,37.08 2.41,36.58 2.41,35.69 2.67,35.43 3.56,35.43 v3.81,35.69
  Bottom 0.203: JP2.8 6.99,50.42 6.99,49.15 6.73,48.9 6.48,48.9 v5.84,49.53 | R7.1 4.57,33.78 4.06,34.29 4.06,35.43 v3.81,35.69
N$8
  Top 0.254: C13.1 R21.1
N$9
  Top 0.254: R24.1 C15.1
N$10
  Bottom 0.203: R25.2 C18.1
N$11  (via drill 0.25)
  Route2 0.203: v12.83,17.91 12.95,17.78 12.95,14.99 v12.06,14.1
  Bottom 0.203: U5.45 12.97,17.76 v12.83,17.91 | v12.06,14.1 11.81,13.84 C10.1
N$12  (via drill 0.25)
  Route2 0.203: v19.68,18.8 19.68,15.11 19.05,14.48 17.4,14.48 v17.27,14.35
  Bottom 0.203: U5.32 19.68,19.57 | 19.68,19.57 20.43,19.57 20.7,19.3 C19.2 | 19.68,19.57 v19.68,18.8 | v17.27,14.35 17.31,14.39 R2.1
N$17
  Top 0.254: C14.1 R22.1
N$20
  Top 0.254: C16.1 R23.1
POWBTN  (via drill 0.25)
  Top 0.203: U1.2 12.72,30.46 v13.21,29.97
  Route2 0.203: v13.21,29.97 13.21,28.19 14.1,27.3 15.24,27.3 15.88,26.67 15.88,24 16.26,23.62 16.89,23.62 17.4,23.11 17.4,21.34 17.78,20.95 17.78,20.19 17.91,20.07 17.91,15.88 16.64,14.61 16.64,13.34 17.02,12.95 v18.03,12.95
  Bottom 0.203: U5.37 16.97,15.32 16.64,14.99 R26.1 17.84,13.15 v18.03,12.95
R_AC
  Top 0.203: C14.2 15.24,41.91 14.99,42.16 14.99,44.96 15.11,45.09 18.92,45.09 19.18,45.34 19.18,50.55 18.92,50.8 4.45,50.8 4.32,50.67 4.32,49.19 J3.RING
  Top 0.254: C14.2 R19.2
RIGHT  (via drill 0.25)
  Top 0.203: R22.2 v22.48,41.91
  Top 0.254: R22.2 R23.2
  Route15 0.203: v15.24,14.99 21.21,14.99 21.72,15.49 21.72,17.02 21.59,17.14 21.59,25.65 21.08,26.16 21.08,26.67 21.59,27.18 21.59,33.66 22.1,34.16 22.1,36.58 21.59,37.08 21.59,41.02 v22.48,41.91
  Bottom 0.203: U5.40 15.47,15.22 v15.24,14.99
RXI  (via drill 0.25)
  Top 0.203: U1.21 13.72,37.84 13.54,38.02 v13.47,38.02 | v2.92,39.12 2.92,36.83 2.54,36.45 2.54,35.31 1.52,34.29 J1.4
  Route15 0.203: v2.92,39.12 5.46,39.12 5.71,38.86 6.22,38.86 6.48,39.12 12.96,39.12 13.47,38.61 v13.47,38.02
SCL  (via drill 0.25)
  Top 0.203: J4.RING2 3.2,25.68 3.56,26.04 | 3.56,26.04 5,26.04 D4.1 | U1.17 15.72,37.87 15.37,38.23 14.99,38.23 14.86,38.35 14.86,39.75 14.48,40.13 6.6,40.13 v6.35,40.39 | 3.56,26.04 3.56,28.07 2.67,28.96 2.67,30.99 2.54,31.11 2.54,33.15 2.75,33.36 R3.1 v3.43,34.67 | U6.1 16.19,9.72 15.11,10.79 13.08,10.79 v12.57,10.29
  Top 0.254: J4.RING2 3.2,19.58 2.67,19.05 1.65,19.05 v1.02,18.41
  Route2 0.203: v6.35,40.39 5.97,40.39 5.33,39.75 5.33,38.35 4.7,37.72 4.7,37.08 5.21,36.58 5.21,35.94 4.19,34.92 3.68,34.92 v3.43,34.67
  Route2 0.254: v1.02,18.41 1.02,11.68 1.27,11.43 5.33,11.43 5.84,10.92 6.6,10.92 7.11,11.43 9.65,11.43 10.03,11.81 11.05,11.81 11.43,11.43 12.32,11.43 12.57,11.18 v12.57,10.29
SCL_OUT  (via drill 0.25)
  Top 0.203: J5.RING2 4.5,13.41 v4.7,13.21 | v12.06,9.53 12.95,9.53 13.46,10.03 14.99,10.03 15.24,9.78 U6.2
  Route2 0.203: v4.7,13.21 11.56,13.21 14.35,10.41 14.35,9.91 13.97,9.53 v12.06,9.53
SCLK
  Bottom 0.203: U5.23 16.47,27.21 16.38,27.3 15.75,27.3 15.55,27.5 15.55,29.14 15.62,29.21 U4.6
SD3V3  (via drill 0.25)
  Route2 0.254: v12.57,23.11 8.51,23.11 v8.13,23.5
  Bottom 0.203: U3.3 5.4,27.12 5.28,27 5.28,26.67 | 5.28,26.67 R9.1 | v8.13,23.5 8.13,25.27 8,25.4 7.75,25.4 7.62,25.53 7.62,26.16 7.49,26.29 5.46,26.29 5.46,26.49 5.28,26.67
  Bottom 0.254: U5.17 13.47,23.38 13.21,23.11 v12.57,23.11
SDA  (via drill 0.25)
  Top 0.203: J4.RING1 6.2,24.74 6.92,25.46 D4.2 6.92,28.76 6.99,28.83 6.99,29.59 6.92,29.66 6.92,30.16 6.6,30.48 6.22,30.48 5.97,30.73 5.97,32.26 5.71,32.51 4.95,32.51 4.83,32.64 R4.1 4.83,34.42 v4.7,34.54 | U1.18 15.22,37.48 14.99,37.72 14.48,37.72 14.35,37.85 14.35,39.12 13.84,39.62 5.97,39.62 v5.97,39.5 | v20.83,9.53 20.83,10.16 20.7,10.29 20.19,10.29 20,10.09 U7.1
  Top 0.254: J4.RING1 6.2,17.38 5.97,17.14 v2.29,17.14
  Route2 0.203: v5.97,39.5 5.97,39.12 6.22,38.86 6.22,36.07 v4.7,34.54
  Route15 0.203: v2.29,17.14 2.29,11.05 2.79,10.54 2.79,7.75 3.05,7.49 20.57,7.49 20.83,7.75 v20.83,9.53
SDA_OUT  (via drill 0.25)
  Top 0.203: U7.2 v19.05,10.29 | J5.RING1 6.2,11.58 v6.22,11.56
  Route15 0.203: v6.22,11.56 9.91,11.56 10.16,11.81 18.03,11.81 19.05,10.79 v19.05,10.29
SDCD  (via drill 0.25)
  Route2 0.203: v10.16,38.1 11.3,38.1 11.68,37.72 11.68,37.47 11.81,37.34 11.81,36.83 11.68,36.7 11.68,31.62 12.19,31.11 12.19,30.86 11.68,30.35 11.68,27.43 12.19,26.92 14.99,26.92 15.37,26.54 15.37,23.24 15.62,22.99 v16.64,22.99
  Bottom 0.203: U5.21 15.47,23.26 15.75,22.99 v16.64,22.99 | JP2.CD1 7.76,39.1 8.2,38.66 R11.1 v10.16,38.1
SDCK  (via drill 0.25)
  Route2 0.203: v11.43,30.99 11.05,31.37 11.05,37.21 v11.18,37.08 | v8.89,48.26 v11.81,48.26
  Bottom 0.203: U5.14 11.97,25.24 11.68,25.53 11.68,27.18 11.05,27.81 v11.05,28.45 10.99,28.5 R15.1 10.99,30.55 v11.43,30.99 | v11.18,37.08 11.18,37.34 11.3,37.47 11.3,41.27 11.81,41.78 v11.81,48.26 | JP2.5 10.26,48.74 9.78,48.26 v8.89,48.26
SDDI
  Bottom 0.203: 12.19,33.02 12.19,25.63 12.36,25.46 12.87,25.46 12.97,25.36 U5.16 | 12.19,33.02 12.19,36.96 11.68,37.47 11.68,41.02 12.41,41.75 JP2.3 | R16.1 12.19,33.02
SDDO  (via drill 0.25)
  Route2 0.203: v10.54,26.92 10.54,27.81 10.29,28.07 10.29,34.04 9.53,34.8 9.53,37.59 9.27,37.85 9.27,40.13 8.76,40.64 7.11,40.64 6.73,41.02 5.97,41.02 5.59,40.64 v5.33,40.64
  Bottom 0.203: R14.1 v5.33,40.64 5.33,46.86 5.97,47.5 7.75,47.5 8.04,47.79 JP2.7 | U5.13 11.12,24.57 10.92,24.77 10.92,26.54 v10.54,26.92
SDXCS
  Bottom 0.203: 14.73,36.83 14.73,34.16 13.84,33.27 13.84,30.23 14.73,29.34 14.73,26.92 14.97,26.68 U5.20 | 14.73,36.83 14.73,47.24 13.47,48.51 JP2.2 | R17.1 14.73,36.83
SI  (via drill 0.25)
  Route2 0.203: v19.18,31.24 19.18,30.86 18.92,30.61 18.03,30.61 17.78,30.86 17.53,30.86 17.27,30.61 17.27,27.13 v17.25,27.11
  Bottom 0.203: U5.24 16.97,26.83 v17.25,27.11 | 19.3,31.11 v19.18,31.24 19.94,30.48 U4.2
SO
  Bottom 0.203: U5.25 19.26,23.07 19.43,23.24 19.43,27.43 18.92,27.94 U4.5
SWD_CLK
  Top 0.203: U1.12 22.61,34.04 J2.4
SWD_DATA
  Top 0.203: U1.11 23.61,33.54 J2.5
TXO  (via drill 0.25)
  Top 0.203: U1.22 13.22,37.44 13.09,37.57 12.99,37.57 12.88,37.68 12.88,38.41 12.78,38.51 v12.27,38.51
  Route15 0.203: J1.5 2.92,38.48 9.65,38.48 9.91,38.73 10.41,38.73 10.67,38.48 12.24,38.48 v12.27,38.51
USBN
  Bottom 0.203: U5.36 19.13,17.57 19.43,17.27 19.43,11.18 20.03,10.58 R27.1 22.9,10.58 22.99,10.67 22.99,11.3 23.11,11.43 J6.1
USBP
  Bottom 0.203: U5.35 19.52,18.07 19.81,17.78 19.81,12.57 19.94,12.45 20.7,12.45 20.83,12.57 20.83,14.1 21.12,14.39 R28.1 22.82,14.39 23.24,13.97 J6.2
VCC
  Top 0.203: U1.25 10.82,36.04 10.67,36.2 10.67,36.7 10.41,36.96 C4.1
VCCIO  (via drill 0.25)
  Route15 0.203: v19.3,35.31 20.32,36.32 20.32,40.26 19.81,40.77 17.53,40.77 16.89,40.13 v16.89,38.86 16.89,29.21 16,28.32 16,23.5 15.62,23.11 15.62,20.83 | 9.53,22.86 9.53,21.34 10.29,20.57 v11.68,20.57 12.7,21.59 v13.46,21.59 14.22,20.83 15.62,20.83 | 9.53,22.86 v9.53,27.94 | 9.53,22.86 v4.57,22.86 4.57,17.91 v4.7,17.78 | v17.02,20.83 15.62,20.83 | v5.46,37.47 5.46,34.16 v8.51,31.11
  Bottom 0.203: v13.46,21.59 14.22,21.59 14.47,21.84 U5.19 14.47,25.28 13.84,25.91 C12.1 | U5.30 17.28,20.57 v17.02,20.83 | R12.2 v4.7,17.78 | v9.53,27.94 9.83,28.25 R15.2 9.83,31.06 9.58,31.31 R16.2 8.76,33.02 8.51,32.77 v8.51,31.11 | R13.2 v4.57,22.86 | R17.2 17.09,38.66 v16.89,38.86 | R29.2 19.74,34.87 v19.3,35.31 | R11.2 6.1,38.1 v5.46,37.47 3.81,37.47 3.68,37.59 3.68,39.37 3.23,39.82 R14.2
  Bottom 0.254: U5.7 v11.68,20.57
VDD
  Bottom 0.203: U3.5 7.3,31.43 7.2,31.54 C20.1 7.2,32.8 6.8,33.2 R7.2 6.8,34.49 6.93,34.62 R8.2 6.93,36.14 7.24,36.45 9.65,36.45 10.92,37.72 10.92,41.53 11.32,41.92 11.32,43.67 10.92,44.07 9.4,44.07 9.14,44.32 9.14,47.24 9.64,47.74 10.14,47.74 11.32,48.91 JP2.4
VDDA
  Bottom 0.203: U5.34 17.65,18.57 17.62,18.54 15.75,18.54 | 15.75,18.54 15.75,17.27 15.97,17.05 U5.39 15.97,14.32 15.88,14.22 15.37,14.22 15.24,14.1 C11.1 | U5.44 13.47,18.4 13.46,18.41 13.46,18.54 | 13.46,18.54 12.45,18.54 12.19,18.29 12.19,17.53 12.47,17.24 U5.46 | 15.75,18.54 13.46,18.54
VIN  (via drill 0.25)
  Top 0.254: D1.2 16.24,20.59 16.51,20.32 16.51,19.43 v15.88,19.43 | 11.56,6.48 12.57,6.48 12.7,6.6 12.7,7.49 12.83,7.62 16.13,7.62 | 16.13,7.62 19.3,7.62 | 19.3,7.62 19.68,7.62 20,7.3 U7.5 | 16.13,7.62 16.19,7.56 U6.5 16.19,4.2 C23.1 | C24.1 19.38,7.55 19.3,7.62
  Top 0.406: 13.84,19.43 13.84,17.78 13.13,17.07 J4.EARTH 11.3,15.49 11.05,15.24 9.14,15.24 8.89,14.99 8.89,11.43 11.3,9.02 11.3,6.73 11.56,6.48 11.56,6.65 J5.EARTH | 13.84,19.43 14.61,19.43 | 14.61,19.43 v15.88,19.43 | v12.98,26.04 13.04,25.98 C6.1 14.41,26.04 14.86,26.04 15.07,26.25 C5.1 16.6,26.25 16.7,26.35 U2.1 18.86,26.35 19.05,26.16 19.05,24.64 18.86,24.45 U2.3 17.75,22.96 16.64,21.84 15.88,21.84 15.55,21.52 14.79,21.52 14.61,21.34 14.61,19.43 | 13.84,19.43 13.65,19.62 D1.1
  Route2 0.406: v12.98,26.04 8.51,26.04 8.26,26.29 v8.26,27.81
  Bottom 0.203: U5.33 17.51,19.07 17.4,19.18 16.13,19.18 v15.88,19.43
  Bottom 0.406: v8.26,27.81 8.16,27.91 U3.1
VS_RX  (via drill 0.25)
  Top 0.203: U1.14 17.51,35.04 v17.78,35.31
  Route2 0.203: v15.75,38.86 15.75,39.37 16.13,39.75 v19.05,39.75
  Route15 0.203: v12.06,22.23 11.43,22.86 11.43,27.3 12.06,27.94 12.06,30.23 12.7,30.86 12.7,36.07 12.95,36.32 13.21,36.32 v15.75,38.86 | v17.78,35.31 19.05,36.58 v19.05,39.75
  Bottom 0.203: U5.27 15.47,22.07 15.11,21.72 15.11,20.95 14.86,20.7 12.83,20.7 12.57,20.95 12.57,21.72 v12.06,22.23
VS_TX  (via drill 0.25)
  Top 0.203: U1.13 17.9,34.54 18.03,34.67 v18.41,34.67
  Route15 0.203: v18.8,23.75 18.8,29.72 19.05,29.97 20.07,29.97 20.32,30.23 20.32,34.42 20.07,34.67 v18.41,34.67
  Bottom 0.203: U5.26 17.43,22.57 17.4,22.61 17.4,23.5 17.78,23.88 18.67,23.88 v18.8,23.75
XCS  (via drill 0.25)
  Route2 0.203: v14.61,30.61 16.51,30.61 19.05,33.15 20.32,33.15 20.45,33.27 22.1,33.27 22.23,33.4 22.23,35.05 21.97,35.31 v20.95,35.31
  Bottom 0.203: U5.22 15.97,26.7 15.75,26.92 15.29,26.92 15.17,27.05 15.17,30.3 14.86,30.61 v14.61,30.61 | v20.95,35.31 20.9,35.25 R29.1 21.46,34.29 22.17,33.58 U4.1
XRES  (via drill 0.25)
  Top 0.203: U1.24 12.22,37.67 v12.27,37.72 11.18,37.72 10.92,37.97 10.92,38.48 10.67,38.73 R1.1 | v12.87,27.69 11.96,27.69 SW1.1
  Route2 0.203: v12.87,27.69 12.45,27.69 12.19,27.94 12.19,30.1 12.7,30.61 12.7,31.37 12.32,31.75 12.32,37.67 v12.27,37.72 12.78,37.21 14.22,37.21 14.61,37.59 14.61,37.85 14.86,38.1 J2.3
XRST
  Bottom 0.203: C17.1 7.2,17.06 6.93,17.33 R12.1 8.26,17.78 8.46,17.57 U5.1
XTAL0
  Bottom 0.203: C8.2 22.26,18.38 21.96,18.68 Y1.1 21.28,19.74 21.08,19.94 21.08,20.32 20.92,20.49 R18.1 19.52,20.49 19.43,20.57 19.43,20.95 19.32,21.07 U5.29
XTAL1
  Bottom 0.203: C7.2 23.96,24.8 24.26,24.5 Y1.3 24.26,21.72 24.11,21.57 21.48,21.57 20.87,22.19 R18.2 19.52,22.19 19.43,22.1 19.43,21.72 19.28,21.57 U5.28

### Text on the board
Top: 1
Route2: 2
Route15: 3
Bottom: 4 | v10
tPlace: Audio Out | In | Audio / Output | Out
Measures: (typ.) | (typ.) | Dimensions in inches
tDocu: Mike Hord | Mike Hord